# Altium schematic sheet 2_BSPD.SchDoc
size A3; SheetNumber: 2; SheetTotal: 8
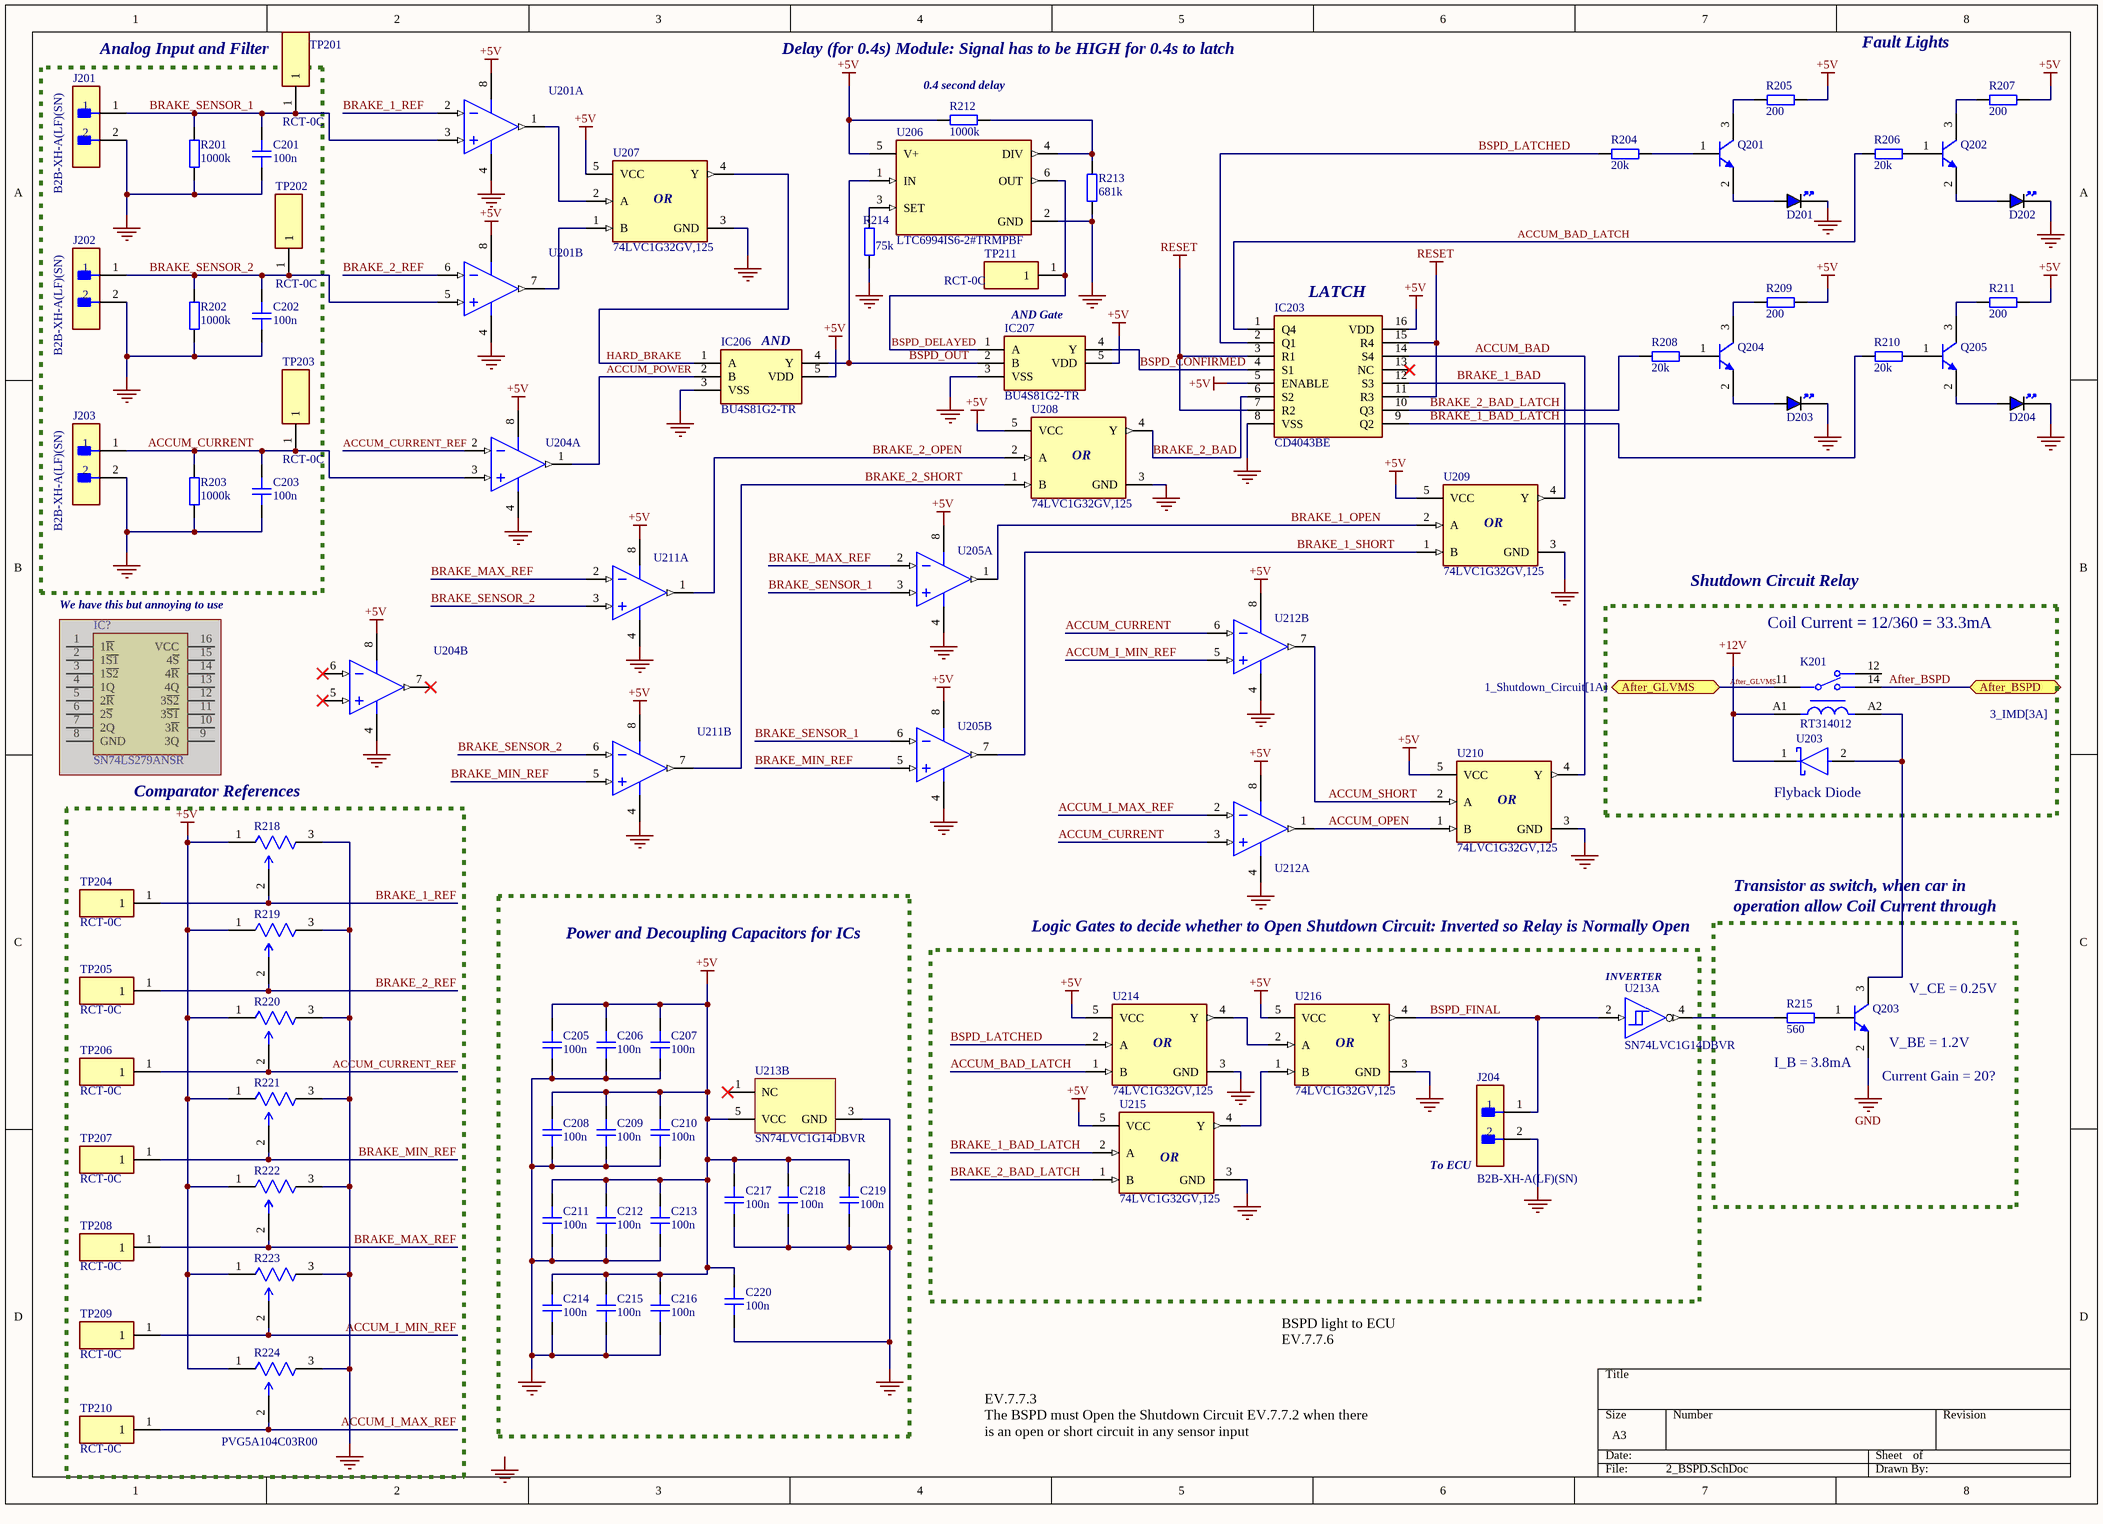
[diagram p0: 2_BSPD.SchDoc]

## Parts
C201  100n  [CAP_0805]
C202  100n  [CAP_0805]
C203  100n  [CAP_0805]
C205  100n  [CAP_0805]
C206  100n  [CAP_0805]
C207  100n  [CAP_0805]
C208  100n  [CAP_0805]
C209  100n  [CAP_0805]
C210  100n  [CAP_0805]
C211  100n  [CAP_0805]
C212  100n  [CAP_0805]
C213  100n  [CAP_0805]
C214  100n  [CAP_0805]
C215  100n  [CAP_0805]
C216  100n  [CAP_0805]
C217  100n  [CAP_0805]
C218  100n  [CAP_0805]
C219  100n  [CAP_0805]
C220  100n  [CAP_0805]
D201  BLUE  [LED_0805_BLUE]  (value not drawn)
D202  BLUE  [LED_0805_BLUE]  (value not drawn)
D203  BLUE  [LED_0805_BLUE]  (value not drawn)
D204  BLUE  [LED_0805_BLUE]  (value not drawn)
IC203  CD4043BE  [DIP794W53P254L1930H508Q16N]
IC206  BU4S81G2-TR  [SOT95P280X125-5N]
IC207  BU4S81G2-TR  [SOT95P280X125-5N]
IC?  SN74LS279ANSR  [SOIC127P780X200-16N]  (masked out: inside a compile mask, not in the netlist)
J201  B2B-XH-A(LF)(SN)  [FP-B2B-XH-A_LF_SN-MFG]
J202  B2B-XH-A(LF)(SN)  [FP-B2B-XH-A_LF_SN-MFG]
J203  B2B-XH-A(LF)(SN)  [FP-B2B-XH-A_LF_SN-MFG]
J204  B2B-XH-A(LF)(SN)  [FP-B2B-XH-A_LF_SN-MFG]
K201  RT314012  [FP-RT314012-MFG]
Q201  MMBT5550LT1G  [ONSC-SOT-23-3-318-08_V]  (value not drawn)
Q202  MMBT5550LT1G  [ONSC-SOT-23-3-318-08_V]  (value not drawn)
Q203  MMBT5550LT1G  [ONSC-SOT-23-3-318-08_V]  (value not drawn)
Q204  MMBT5550LT1G  [ONSC-SOT-23-3-318-08_V]  (value not drawn)
Q205  MMBT5550LT1G  [ONSC-SOT-23-3-318-08_V]  (value not drawn)
R201  1000k  [RES_0805]
R202  1000k  [RES_0805]
R203  1000k  [RES_0805]
R204  20k  [RES_0805]
R205  200  [RES_0805]
R206  20k  [RES_0805]
R207  200  [RES_0805]
R208  20k  [RES_0805]
R209  200  [RES_0805]
R210  20k  [RES_0805]
R211  200  [RES_0805]
R212  1000k  [RES_0805]
R213  681k  [RES_0805]
R214  75k  [RES_0805]
R215  560  [RES_0805]
R218  PVG5A104C03R00  [FP-PVG5A-MFG]  (value not drawn)
R219  PVG5A104C03R00  [FP-PVG5A-MFG]  (value not drawn)
R220  PVG5A104C03R00  [FP-PVG5A-MFG]  (value not drawn)
R221  PVG5A104C03R00  [FP-PVG5A-MFG]  (value not drawn)
R222  PVG5A104C03R00  [FP-PVG5A-MFG]  (value not drawn)
R223  PVG5A104C03R00  [FP-PVG5A-MFG]  (value not drawn)
R224  PVG5A104C03R00  [FP-PVG5A-MFG]
TP201  RCT-0C  [RCT-0C]
TP202  RCT-0C  [RCT-0C]
TP203  RCT-0C  [RCT-0C]
TP204  RCT-0C  [RCT-0C]
TP205  RCT-0C  [RCT-0C]
TP206  RCT-0C  [RCT-0C]
TP207  RCT-0C  [RCT-0C]
TP208  RCT-0C  [RCT-0C]
TP209  RCT-0C  [RCT-0C]
TP210  RCT-0C  [RCT-0C]
TP211  RCT-0C  [RCT-0C]
U201  TLC2272AQDRQ1  [D0008A_N]  (value not drawn)  (parts A,B of 2)
U203  BAT54JFILM  [FP-SOD323-MFG]  (value not drawn)
U204  TLC2272AQDRQ1  [D0008A_N]  (value not drawn)  (parts A,B of 2)
U205  TLC2272AQDRQ1  [D0008A_N]  (value not drawn)  (parts A,B of 2)
U206  LTC6994IS6-2#TRMPBF  [FP-S6-6-05-08-1636-IPC_A]
U207  74LVC1G32GV,125  [FP-SOT753-MFG]
U208  74LVC1G32GV,125  [FP-SOT753-MFG]
U209  74LVC1G32GV,125  [FP-SOT753-MFG]
U210  74LVC1G32GV,125  [FP-SOT753-MFG]
U211  TLC2272AQDRQ1  [D0008A_N]  (value not drawn)  (parts A,B of 2)
U212  TLC2272AQDRQ1  [D0008A_N]  (value not drawn)  (parts A,B of 2)
U213  SN74LVC1G14DBVR  [DBV0005A_L]  (parts A,B of 2)
U214  74LVC1G32GV,125  [FP-SOT753-MFG]
U215  74LVC1G32GV,125  [FP-SOT753-MFG]
U216  74LVC1G32GV,125  [FP-SOT753-MFG]

## Blocks framed on the sheet
Analog Input and Filter: C201-C203 J201-J203 R201-R203 TP201-TP203
Comparator References: R218-R224 TP204-TP210
Power and Decoupling Capacitors for ICs: C205-C220 U213
operation allow Coil Current through: Q203 R215

## Ports
After_BSPD (bidir, see 3_IMD[3A]), After_GLVMS (bidir, see 1_Shutdown_Circuit[1A])

## Nets
+5V: C205.2 C206.2 C207.2 C208.2 C209.2 C210.2 C211.2 C212.2 C213.2 C214.2 C215.2 C216.2 C217.1 C218.1 C219.1 C220.1 IC203.5(ENABLE) IC203.16(VDD) IC206.5(VDD) IC207.5(VDD) R205.2 R207.2 R209.2 R211.2 R212.2 R218.1(CCW) R219.1(CCW) R220.1(CCW) R221.1(CCW) R222.1(CCW) R223.1(CCW) R224.1(CCW) U201.8(VDD+) U204.8(VDD+) U205.8(VDD+) U206.5(V+) U207.5(VCC) U208.5(VCC) U209.5(VCC) U210.5(VCC) U211.8(VDD+) U212.8(VDD+) U213.5(VCC) U214.5(VCC) U215.5(VCC) U216.5(VCC)
+12V: K201.A1 U203.1(C)
GND: C201.1 C202.1 C203.1 C205.1 C206.1 C207.1 C208.1 C209.1 C210.1 C211.1 C212.1 C213.1 C214.1 C215.1 C216.1 C217.2 C218.2 C219.2 C220.2 D201.K D202.K D203.K D204.K IC203.8(VSS) IC206.3(VSS) IC207.3(VSS) J201.2 J202.2 J203.2 J204.2 Q203.2(E) R201.1 R202.1 R203.1 R213.2 R214.1 R218.3(CW) R219.3(CW) R220.3(CW) R221.3(CW) R222.3(CW) R223.3(CW) R224.3(CW) U201.4(VDD-/GND) U204.4(VDD-/GND) U205.4(VDD-/GND) U206.2(GND) U207.3(GND) U208.3(GND) U209.3(GND) U210.3(GND) U211.4(VDD-/GND) U212.4(VDD-/GND) U213.3(GND) U214.3(GND) U215.3(GND) U216.3(GND)
RESET: IC203.3(R1) IC203.7(R2) IC203.11(R3) IC203.15(R4)
ACCUM_BAD: IC203.14(S4) U210.4(Y)
ACCUM_BAD_LATCH: IC203.1(Q4) R206.2 U214.1(B)
ACCUM_CURRENT: C203.2 J203.1 R203.2 TP203.1 U204.3(IN1+) U212.3(IN1+) U212.6(IN2-)
ACCUM_CURRENT_REF: R220.2(WIPER) TP206.1 U204.2(IN1-)
ACCUM_I_MAX_REF: R224.2(WIPER) TP210.1 U212.2(IN1-)
ACCUM_I_MIN_REF: R223.2(WIPER) TP209.1 U212.5(IN2+)
ACCUM_OPEN: U210.1(B) U212.1(OUT1)
ACCUM_POWER: IC206.2(B) U204.1(OUT1)
ACCUM_SHORT: U210.2(A) U212.7(OUT2)
After_BSPD: K201.14 ; port After_BSPD
After_GLVMS: K201.11 ; port After_GLVMS
BRAKE_1_BAD: IC203.12(S3) U209.4(Y)
BRAKE_1_BAD_LATCH: IC203.9(Q2) R210.2 U215.2(A)
BRAKE_1_OPEN: U205.1(OUT1) U209.2(A)
BRAKE_1_REF: R218.2(WIPER) TP204.1 U201.2(IN1-)
BRAKE_1_SHORT: U205.7(OUT2) U209.1(B)
BRAKE_2_BAD: IC203.6(S2) U208.4(Y)
BRAKE_2_BAD_LATCH: IC203.10(Q3) R208.2 U215.1(B)
BRAKE_2_OPEN: U208.2(A) U211.1(OUT1)
BRAKE_2_REF: R219.2(WIPER) TP205.1 U201.6(IN2-)
BRAKE_2_SHORT: U208.1(B) U211.7(OUT2)
BRAKE_MAX_REF: R222.2(WIPER) TP208.1 U205.2(IN1-) U211.2(IN1-)
BRAKE_MIN_REF: R221.2(WIPER) TP207.1 U205.5(IN2+) U211.5(IN2+)
BRAKE_SENSOR_1: C201.2 J201.1 R201.2 TP201.1 U201.3(IN1+) U205.3(IN1+) U205.6(IN2-)
BRAKE_SENSOR_2: C202.2 J202.1 R202.2 TP202.1 U201.5(IN2+) U211.3(IN1+) U211.6(IN2-)
BSPD_CONFIRMED: IC203.4(S1) IC207.4(Y)
BSPD_DELAYED: IC207.1(A) TP211.1 U206.6(OUT)
BSPD_FINAL: J204.1 U213.2(A) U216.4(Y)
BSPD_LATCHED: IC203.2(Q1) R204.2 U214.2(A)
BSPD_OUT: IC206.4(Y) IC207.2(B) U206.1(IN)
HARD_BRAKE: IC206.1(A) U207.4(Y)
NetD201_A: D201.A Q201.2(E)
NetD202_A: D202.A Q202.2(E)
NetD203_A: D203.A Q204.2(E)
NetD204_A: D204.A Q205.2(E)
NetK201_A2: K201.A2 Q203.3(C) U203.2(A)
NetQ201_1: Q201.1(B) R204.1
NetQ201_3: Q201.3(C) R205.1
NetQ202_1: Q202.1(B) R206.1
NetQ202_3: Q202.3(C) R207.1
NetQ203_1: Q203.1(B) R215.2
NetQ204_1: Q204.1(B) R208.1
NetQ204_3: Q204.3(C) R209.1
NetQ205_1: Q205.1(B) R210.1
NetQ205_3: Q205.3(C) R211.1
NetR212_1: R212.1 R213.1 U206.4(DIV)
NetR214_2: R214.2 U206.3(SET)
NetR215_1: R215.1 U213.4(Y)
NetU201_1: U201.1(OUT1) U207.2(A)
NetU201_7: U201.7(OUT2) U207.1(B)
NetU214_4: U214.4(Y) U216.2(A)
NetU215_4: U215.4(Y) U216.1(B)

Not connected (* = marked no-connect by the designer): IC203 13(NC)*; K201 12; U204 5(IN2+)* 6(IN2-)* 7(OUT2)*; U213 1(NC)*

## Notes on the sheet
- Fault Lights
- Delay (for 0.4s) Module: Signal has to be HIGH for 0.4s to latch
- (near R212) 0.4 second delay
- (near U207) OR
- AND Gate
- (near IC203) LATCH
- (near IC206) AND
- (near U208) OR
- (near U209) OR
- Shutdown Circuit Relay
- (near IC?) We have this but annoying to use
- (near K201) Coil Current = 12/360 = 33.3mA
- (near U210) OR
- (near U203) Flyback Diode
- Transistor as switch, when car in
- Logic Gates to decide whether to Open Shutdown Circuit: Inverted so Relay is Normally Open
- (near U213) INVERTER
- (near Q203) V_CE = 0.25V
- (near U214) OR
- (near U216) OR
- (near Q203) V_BE = 1.2V
- I_B = 3.8mA
- (near Q203) Current Gain = 20?
- (near U215) OR
- (near J204) To ECU
- BSPD light to ECU
  EV.7.7.6
- EV.7.7.3
  The BSPD must Open the Shutdown Circuit EV.7.7.2 when there is an open or short circuit in any sensor input
- Labels drawn without touching a wire or pin: GND

## Library data of the parts
C201-C203 C205-C220 = CAP_0805: Capacitor SMD 0805; Manufacturer: *; Manufacturer Part Number: *; Distributor Link: *; LCSC: *; Rating: *; Dielectric: *
D201-D204 = LED_0805_BLUE: LED 0805 BLUE SMD; Manufacturer: *; Manufacturer Part Number: *; Distributor Link: *; LCSC: *
IC203 = CD4043BE: Integrated Circuit; Manufacturer_Name: Texas Instruments; Datasheet Link: http://www.ti.com/lit/ds/symlink/cd4043b.pdf; Height: 5.08mm; Manufacturer_Part_Number: CD4043BE; Mouser Part Number: 595-CD4043BE; Mouser Price/Stock: https://www.mouser.co.uk/ProductDetail/Texas-Instruments/CD4043BE?qs=5h8QSfodyRh52gnjNYecnw%3D%3D; Arrow Part Number: CD4043BE; Arrow Price/Stock: https://www.arrow.com/en/products/cd4043be/texas-instruments?region=nac
IC206 IC207 = BU4S81G2-TR: 2 input AND Gate; Manufacturer_Name: ROHM Semiconductor; Datasheet Link: https://datasheet.datasheetarchive.com/originals/distributors/Datasheets_SAMA/21777083f110a10ff84f688f34e42d67.pdf; Height: 1.25mm; Manufacturer_Part_Number: BU4S81G2-TR; Mouser Part Number: 755-BU4S81G2-TR; Mouser Price/Stock: https://www.mouser.co.uk/ProductDetail/ROHM-Semiconductor/BU4S81G2-TR?qs=4kLU8WoGk0tE1tJdygJcrQ%3D%3D; Arrow Part Number: BU4S81G2-TR; Arrow Price/Stock: http://www.arrow.com/en/products/bu4s81g2-tr/rohm-semiconductor
IC? = SN74LS279ANSR: Integrated Circuit; Manufacturer_Name: Texas Instruments; Datasheet Link: http://www.ti.com/lit/gpn/sn74ls279a; Height: 2mm; Manufacturer_Part_Number: SN74LS279ANSR; Mouser Part Number: 595-SN74LS279ANSR; Mouser Price/Stock: https://www.mouser.co.uk/ProductDetail/Texas-Instruments/SN74LS279ANSR?qs=IF4wzcbwb3qSPGv5mVkBDw%3D%3D; Arrow Part Number: SN74LS279ANSR; Arrow Price/Stock: https://www.arrow.com/en/products/sn74ls279ansr/texas-instruments?region=nac
J201-J204 = CMP-2000-05888-3: CONN HEADER VERT 2POS 2.5MM; Current Rating: 3A; Voltage Rating: 250V; Number of Contacts: 2; Contact Resistance: 20mR; Wire/Cable Gauge: 22AWG; Insulation Resistance: 1GR; Connector Type: Male Pin; Packaging: Bulk; Contact Material: Brass; Lead Free: Lead Free; Orientation: Straight; Contact Plating: Tin; Max Current Rating: 3A; Termination: Solder; Fastening Type: Detent; Depth: 5.75mm; Housing Material: Polyamide; REACH SVHC: No SVHC; Series: XH; Voltage Rating (AC): 250V; Number of Positions: 2; Color: Natural; Contact Type: Male Pin; Max Voltage Rating (DC): 250V; Pitch: 2.5mm; Lead Pitch: 2.5mm; Mount: Through Hole; Max Operating Temperature: 85°C; Length: 7.4mm; Max Voltage Rating (AC): 250V; Min Operating Temperature: -25°C; Number of Rows: 1; Housing Color: White
K201 = CMP-03395-000105-1: RELAY GEN PURPOSE SPDT 16A 12V; Manufacturer: TE Connectivity; Coil Type: Non-Latching; Number Of Contacts: 1; Coil Power: 400mW; Coil Resistance: 360Ω; Device Class L2: Relays; Digikey Description: RELAY GEN PURPOSE SPDT 16A 12V; Coil Voltage: 12V; RoHS: TRUE; Category: Relay; Lead Free: Yes; Manufacturer Part Number: RT314012; ComponentLink2Description: Datasheet; Throw Configuration: SPDT; Current Rating: 16A; Ambient Temperature Range Low: -40°C; ComponentLink2URL: https://www.te.com/commerce/DocumentDelivery/DDEController?Action=showdoc&DocId=Data+Sheet%7FRT1%7F0219%7Fpdf%7FEnglish%7FENG_DS_RT1_0219.pdf%7F9-1393239-5; Automotive: No; Device Class L1: Electromechanical; Octopart: https://octopart.com/9-1393239-5-te+connectivity-46509288; Ambient Temperature Range High: +85°C; Height: 15.7mm; Package: RT314012; Device Class L3: Power Relays
Q201-Q205 = CMP-1048-00659-1: High Voltage Transistor, NPN Silicon, 3-Pin SOT-23, Pb-Free, Tape and Reel; Manufacturer: On Semiconductor; IC Continuous (A): 0.6; PackageDescription: 3-Pin Small Outline Transistor, Body 2.92 x 1.3 mm, Pitch 0.95 mm; ComponentLink3URL: http://www.onsemi.cn/pub_link/Collateral/318-08.PDF; RoHS: TRUE; ComponentLink2URL: http://www.onsemi.cn/pub_link/Collateral/MMBT5550LT1-D.PDF; DatasheetVersion: Rev. 10; ComponentLink1URL: http://www.onsemi.com/; PackageReference: SOT-23-3-318-08; PackageVersion: Rev. AP, 11/2009; Mounting Technology: Surface Mount; ComponentLink2Description: Datasheet; PartNumber: MMBT5550LT1G; ComponentLink3Description: Package Specification; Packing: Tape and Reel; Polarity: NPN; ComponentLink1Description: Manufacturer URL
R201-R215 = RES_0805: Resistor SMD 0805; Manufacturer: *; Manufacturer Part Number: *; Distributor Link: *; LCSC: *
R218-R224 = CMP-00059-71612330-1: PVG5A104C03R00 Resistor Trimmer, Cermet, 100 kOhm, ± 10%, 250 mW, 12 Turn, Multi Turn, Surface Mount; Power Rating: 250mW; Resistance: 100kΩ; Temperature Coefficient: 150ppm/°C; Number of Turns: 11; Min Operating Temperature: -55°C; RoHS: Compliant; Max Power Dissipation: 250mW; Height: 5.1054mm; Composition: Cermet; Max Operating Temperature: 125°C; Tolerance: 10%; Mount: Surface Mount; Schedule B: 8533400080, 8533400080; NexarPartId: 71612330
TP201-TP211 = RCT-0C: Test Point; Manufacturer_Name: TE Connectivity; Datasheet Link: https://www.te.com/commerce/DocumentDelivery/DDEController?Action=srchrtrv&DocNm=1773266&DocType=Data%20Sheet&DocLang=English&PartCntxt=1625854-2&DocFormat=pdf; Manufacturer_Part_Number: RCT-0C; Mouser Part Number: 279-RCT-0C; Mouser Price/Stock: https://www.mouser.co.uk/ProductDetail/TE-Connectivity-Holsworthy/RCT-0C?qs=ip69W3eHERWzZOsRKmFYAw%3D%3D; Arrow Part Number: RCT-0C; Arrow Price/Stock: https://www.arrow.com/en/products/rct-0c/te-connectivity?region=nac
U201 U204 U205 U211 U212 = CMP-0272-03289-3: Automotive Catalog Advanced LinCMOS(TM) Rail-to-Rail Operational Amplifier, 4.4 to 16 V, -40 to 125 degC, 8-pin SOIC (D8), Green (RoHS & no Sb/Br); Manufacturer: Texas Instruments; Sub Family: Low Noise Amp (<=10nV/rtHz), Precision Amplifier; Packing: LARGE T&R; IIB(Max)(pA): 60; Vio (25C)(Max)(mV): 0.95; Slew Rate(Typ)(V/us): 3.6; CMRR(Min)(dB): 70; Iq per channel(Max)(mA): 1.5; Offset Drift(Typ)(uV/C): 2; Total Supply Voltage(Max)(+5V is 5, +/-5V is 10): 16; Total Supply Voltage(Min)(+5V is 5, +/-5V is 10): 4.4; GBW(Typ)(MHz): 2.18; PackageVersion: 4040047-3/M, 06/2011; ComponentLink2URL: http://www.ti.com/lit/ds/symlink/tlc2272a-q1.pdf; PackageDescription: 8-Pin Plastic Small Outline, Body 4.9 x 3.9 mm, Pitch 1.27 mm; ComponentLink2Description: Datasheet; ComponentLink3Description: Package Specification; Mounting Technology: Surface Mount; Eco-Plan: Green (RoHS & no Sb/Br); PartNumber: TLC2272AQDRQ1; ComponentLink1Description: Manufacturer URL; DatasheetVersion: SGLS007E; Number of Channels: 2; ComponentLink3URL: http://www.ti.com/litv/pdf/msoi002j; ComponentLink1URL: http://www.ti.com/; Code_JEDEC: MS-012; PackageReference: D0008A; Rating: Automotive
U203 = CMP-2000-05927-2: DIODE SCHOTTKY 40V 300MA SOD323; Manufacturer: STMicroelectronics; Max Surge Forward Current: 1.25A; Value: 7pF; Max Junction Temp: +150°C; Peak Reverse Current: 1uA; Standoff Height: 0mm; ComponentLink2Description: Datasheet; Device Class L2: Diodes; Mouser Description: Schottky Diodes & Rectifiers 300mA 40 Volt; Forward Current: 300mA; Temperature Range Low: -40°C; Temperature Range High: +150°C; Digikey Description: DIODE SCHOTTKY 40V 300MA SOD323; Capacitance: 7pF; Ipc Land Pattern Name: SOD250128X117-2; Automotive: No; Manufacturer Part Number: BAT54JFILM; Device Class L1: Discrete Semiconductors; Lead Free: Yes; ComponentLink2URL: https://www.st.com/resource/en/datasheet/bat54.pdf; Package: SOD323; Temperature: -40°C to +150°C; Category: IC; Height: 1.17mm; Octopart: https://octopart.com/bat54jfilm-stmicroelectronics-326073; RoHS: TRUE; Device Class L3: Schottky Diodes; Max Repetitive Reverse Voltage: 40V
U206 = CMP-09075-000004-1: IC DELAY BLOCK 8TAP PROG TSOT23; Number of Taps/Steps: 8; Case/Package: SOT-23-6; Series: TimerBlox®; Min Operating Temperature: -40°C; Packaging: Tape and Reel; Mount: Surface Mount; Number of Pins: 23; RoHS Compliant: Yes; Package Quantity: 500; Max Operating Temperature: 85°C
U207-U210 U214-U216 = CMP-14350-000001-1: IC GATE OR 1CH 2-INP 5TSOP; Manufacturer: Nexperia; Frequency: 150MHz; Number Of Outputs: 1; Max Supply Voltage: 5.5V; Propagation Delay: 1.7ns; Number Of Inputs: 2; Min Supply Voltage: 1.65V; Standoff Height: 0.013mm; Manufacturer Part Number: 74LVC1G32GV,125; Height: 1.1mm; Category: IC; Logic Function Desc: OR; Digikey Description: IC GATE OR 1CH 2-INP 5TSOP; Package: SOT753; Octopart: https://octopart.com/74lvc1g32gv%2C125-nexperia-78737904; Ambient Temperature Range Low: -40°C; Device Class L2: Logic ICs; Temperature: -40°C to +125°C; Ipc Land Pattern Name: SOT95P275X100-5; ComponentLink2Description: Datasheet; Device Class L1: Integrated Circuits (ICs); Footprint Url: https://assets.nexperia.com/documents/outline-drawing/SOT753.pdf; Number Of Circuits: 1; Device Class L3: Logic Gates; ComponentLink2URL: https://assets.nexperia.com/documents/data-sheet/74LVC1G32.pdf; Temperature Range Low: -40°C; Automotive: No; RoHS: TRUE; Lead Free: Yes; Ambient Temperature Range High: +125°C; Temperature Range High: +125°C
U213 = CMP-0859-00030-4: Single Schmitt-Trigger Inverter, DBV0005A, LARGE T&R; Manufacturer: Texas Instruments; Input Type: CMOS/TTL; Output Drive (IOL/IOH)(Max)(mA): 32/-32; VCC(Min)(V): 1.65; 3-State Output: No; Schmitt Trigger: Yes; tpd @ Nom Voltage(Max)(ns): 11,6.5,5.5,5; VCC(Max)(V): 5.5; Output Type: CMOS; Bits(#): 1; Voltage(Nom)(V): 1.8,2.5,3.3,5; Sub-Family: Inverting Buffer/Driver; Logic: Inverting; Technology Family: LVC; F @ Nom Voltage(Max)(Mhz): 150; Rating: Catalog; ICC @ Nom Voltage(Max)(mA): 0.01; DatasheetVersion: SCES218W; PackageReference: DBV0005A; Generic Part Number: SN74LVC1G14; Operating Temperature Range(C): -40 to 125,-40 to 85